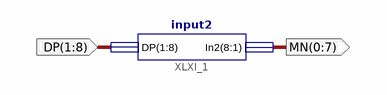
[diagram p0: schematic sheet 1]
// Xilinx ISE schematic lab9t.sch (spartan6) as structural Verilog: 1 symbols, 2 ports
module lab9t (
  input  [1:8] DP,
  output [0:7] MN
);

  input2 XLXI_1 (.DP(DP), .In2(MN));
endmodule
